# EAGLE design power-control (EAGLE 6.4)
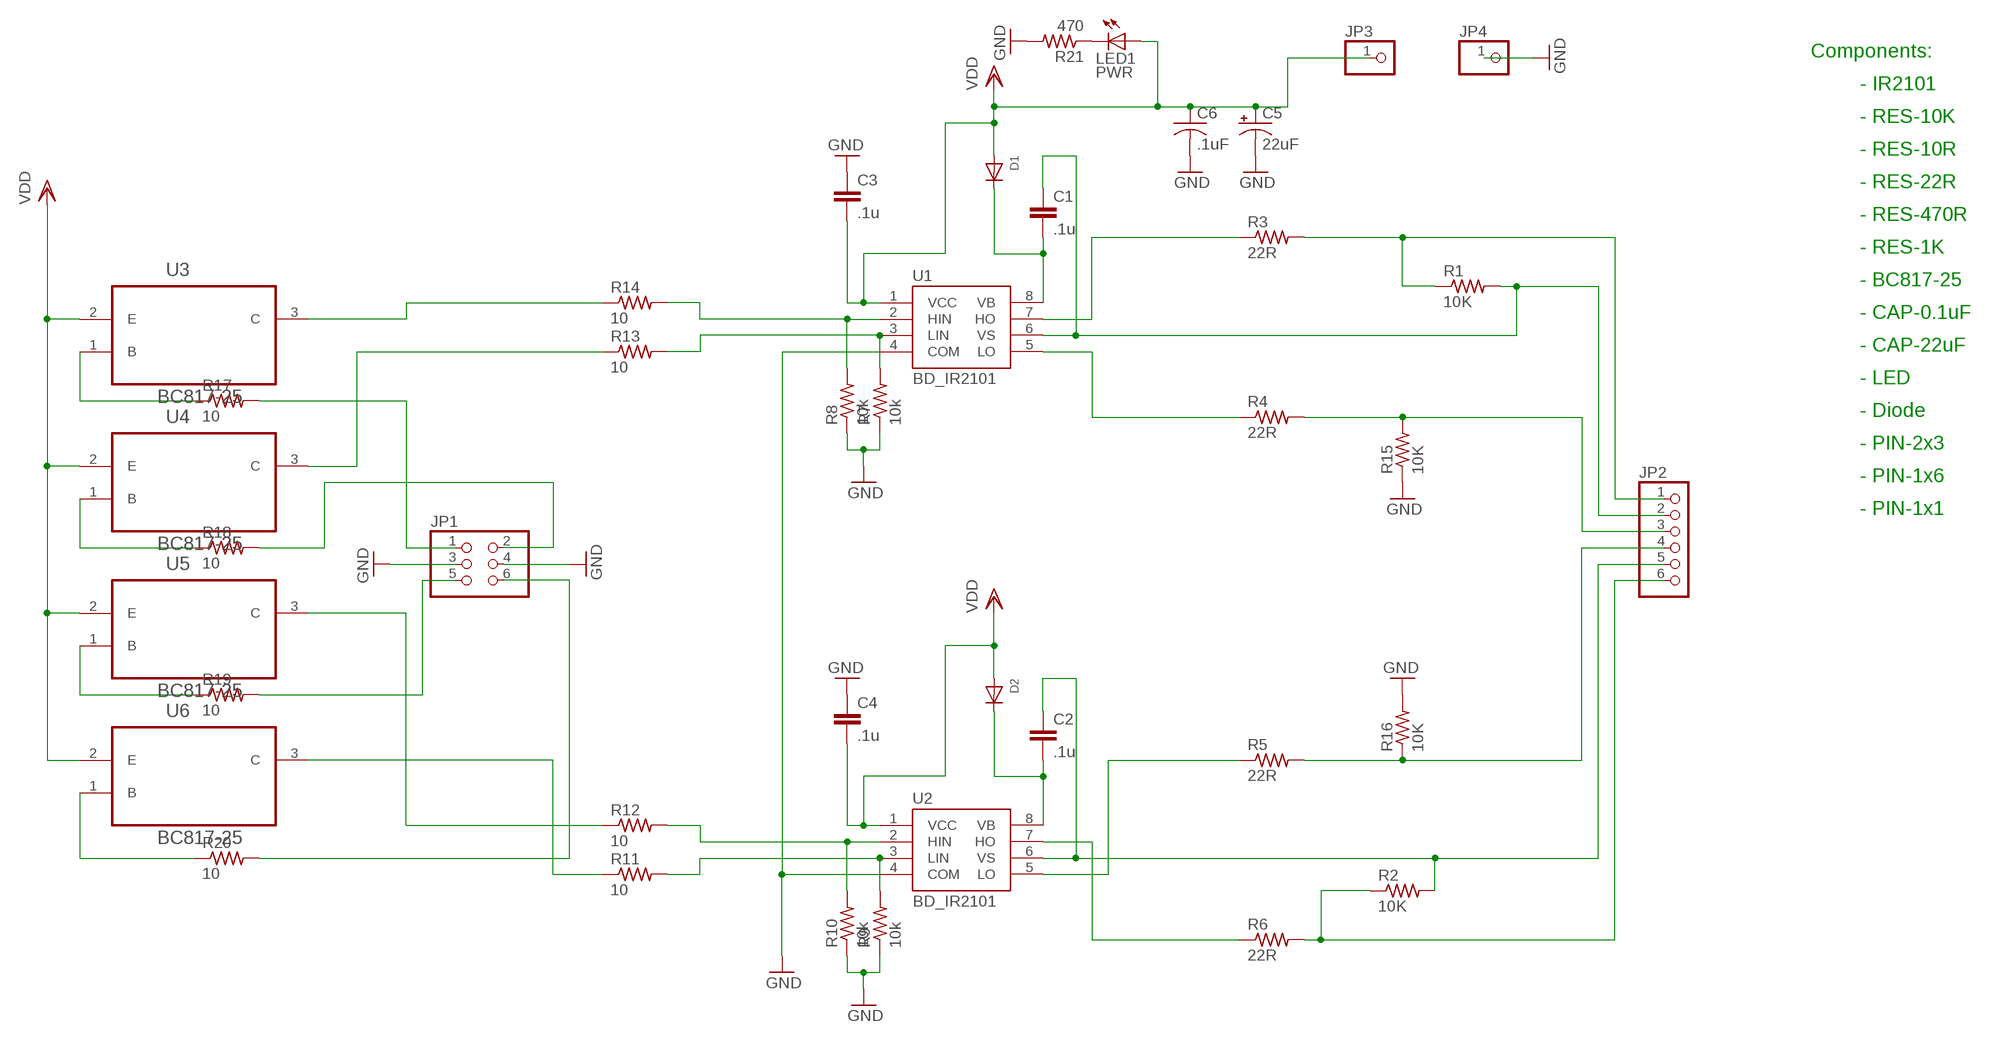
[diagram p0: schematic, sheet 1]

## Parts
C1  .1u  C-EUC0603  [C0603]
C2  .1u  C-EUC0603  [C0603]
C3  .1u  C-EUC0603  [C0603]
C4  .1u  C-EUC0603  [C0603]
C5  22uF  CPOL-USB/3528-21W  [B/3528-21W]
C6  .1uF  C-USC0805  [C0805]
D1  DIODESOD-523  [SOD-523]
D2  DIODESOD-523  [SOD-523]
JP1  PINHD-2X3  [2X03]
JP2  PINHD-1X6  [1X06]
JP3  PINHD-1X1  [1X01]
JP4  PINHD-1X1  [1X01]
LED1  PWR  LEDCHIP-LED0805  [CHIP-LED0805]
R1  10K  R-US_R0603  [R0603]
R2  10K  R-US_R0603  [R0603]
R3  22R  R-US_R0603  [R0603]
R4  22R  R-US_R0603  [R0603]
R5  22R  R-US_R0603  [R0603]
R6  22R  R-US_R0603  [R0603]
R7  10k  R-US_R0603  [R0603]
R8  10k  R-US_R0603  [R0603]
R9  10k  R-US_R0603  [R0603]
R10  10k  R-US_R0603  [R0603]
R11  10  R-US_R0603  [R0603]
R12  10  R-US_R0603  [R0603]
R13  10  R-US_R0603  [R0603]
R14  10  R-US_R0603  [R0603]
R15  10K  R-US_R0603  [R0603]
R16  10K  R-US_R0603  [R0603]
R17  10  R-US_R0603  [R0603]
R18  10  R-US_R0603  [R0603]
R19  10  R-US_R0603  [R0603]
R20  10  R-US_R0603  [R0603]
R21  470  R-US_R0603  [R0603]
U1  BD_IR2101  [SO8]
U2  BD_IR2101  [SO8]
U3  BC817-25  [SOT95P240X97-3N]
U4  BC817-25  [SOT95P240X97-3N]
U5  BC817-25  [SOT95P240X97-3N]
U6  BC817-25  [SOT95P240X97-3N]

## Nets
GND: C3.1 C4.1 C5.- C6.2 JP1.3 JP1.4 JP4.1 R7.1 R8.1 R9.1 R10.1 R15.1 R16.2 R21.2 U1.4(COM) U2.4(COM)
HO_1: R3.1 U1.7(HO)
HO_2: R6.1 U2.7(HO)
LO_1: R4.1 U1.5(LO)
LO_2: R5.1 U2.5(LO)
MOTOR_OUT_1: C1.1 JP2.2 R1.2 U1.6(VS)
MOTOR_OUT_2: C2.1 JP2.5 R2.2 U2.6(VS)
N$1: R13.1 U4.3(C)
N$2: R11.1 U6.3(C)
N$3: R8.2 R14.2 U1.2(HIN)
N$4: R7.2 R13.2 U1.3(LIN)
N$5: R10.2 R12.2 U2.2(HIN)
N$6: R9.2 R11.2 U2.3(LIN)
N$7: C1.2 D1.K(C) U1.8(VB)
N$8: C2.2 D2.K(C) U2.8(VB)
N$9: R12.1 U5.3(C)
N$10: JP2.4 R5.2 R16.1
N$11: R14.1 U3.3(C)
N$12: JP1.1 R17.2
N$13: JP1.5 R19.2
N$14: JP1.2 R18.2
N$15: JP2.1 R1.1 R3.2
N$16: JP1.6 R20.2
N$17: R17.1 U3.1(B)
N$18: R18.1 U4.1(B)
N$19: R19.1 U5.1(B)
N$20: JP2.3 R4.2 R15.2
N$21: R20.1 U6.1(B)
N$22: LED1.C R21.1
N$25: JP2.6 R2.1 R6.2
VDD: C3.2 C4.2 C5.+ C6.1 D1.A D2.A JP3.1 LED1.A U1.1(VCC) U2.1(VCC) U3.2(E) U4.2(E) U5.2(E) U6.2(E)

## Notes on the sheet
- Components:
- - IR2101
- - RES-10K
- - RES-10R
- - RES-22R
- - RES-470R
- - RES-1K
- - BC817-25
- - CAP-0.1uF
- - CAP-22uF
- - LED
- - Diode
- - PIN-2x3
- - PIN-1x6
- - PIN-1x1

## Library data of the parts
C1-C4 = rcl:C-EU: CAPACITOR, European symbol
C5 = rcl:CPOL-US: POLARIZED CAPACITOR, American symbol
C6 = rcl:C-US: CAPACITOR, American symbol
D1 D2 = adafruit:DIODE: Diode SMADIODE - SMA Surface Mount Package 20V 1A Schottky Diode Digikey: 641-1014-6-ND DO-1N4148 - Through Hole Small Current Diode SOD-123 20V 1 A (.5mV Vf) Schottky Diode - Digikey: MBRX120TPMSCT-ND SOD-323 10V 570mA (.38mV Vf, 3ns) Schottky Diode - Digikey: ZLLS410CT-ND SOD-523 30V 30mA Schottky Diode (RB751S-40TE61) - Digikey: RB751S-40TE61CT-ND SOT23-R/W - SOT23 Package (R = Solder Paste/Reflow Ovens, W = Hand-Soldering) BAT54Film 40V 300mA - Digikey: 497-7162-1-ND
JP1 = pinhead:PINHD-2X3: PIN HEADER
JP2 = pinhead:PINHD-1X6: PIN HEADER
JP3 JP4 = pinhead:PINHD-1X1: PIN HEADER
LED1 = adafruit:LED: LED OSRAM: - CHIPLED LG R971, LG N971, LY N971, LG Q971, LY Q971, LO R971, LY R971 LH N974, LH R974 LS Q976, LO Q976, LY Q976 LO Q996 - Hyper CHIPLED LW Q18S LB Q993, LB Q99A, LB R99A - SideLED LS A670, LO A670, LY A670, LG A670, LP A670 LB A673, LV A673, LT A673, LW A673 LH A674 LY A675 LS A676, LA A676, LO A676, LY A676, LW A676 LS A679, LY A679, LG A679 - Hyper Micro SIDELED® LS Y876, LA Y876, LO Y876, LY Y876 LT Y87S - SmartLED LW L88C, LW L88S LB L89C, LB L89S, LG L890 LS L89K, LO L89K, LY L89K LS L896, LA L896, LO L896, LY L896 - TOPLED LS T670, LO T670, LY T670, LG T670, LP T670 LSG T670, LSP T670, LSY T670, LOP T670, LYG T670 LG T671, LOG T671, LSG T671 LB T673, LV T673, LT T673, LW T673 LH T674 LS T676, LA T676, LO T676, LY T676, LB T676, LH T676, LSB T676, LW T676 LB T67C, LV T67C, LT T67C, LS T67K, LO T67K, LY T67K, LW E67C LS E67B, LA E67B, LO E67B, LY E67B, LB E67C, LV E67C, LT E67C LW T67C LS T679, LY T679, LG T679 LS T770, LO T770, LY T770, LG T770, LP T770 LB T773, LV T773, LT T773, LW T773 LH T774 LS E675, LA E675, LY E675, LS T675 LS T776, LA T776, LO T776, LY T776, LB T776 LHGB T686 LT T68C, LB T68C - Hyper Mini TOPLED® LB M676 - Mini TOPLED Santana® LG M470 LS M47K, LO M47K, LY M47K Source: http://www.osram.convergy.de/
R1-R21 = rcl:R-US_: RESISTOR, American symbol
U1 U2 = open-bldc:BD
U3-U6 = Fairchild_By_element14_Batch_1:BC817-25: NPN Epitaxial Silicon Transistor; MPN: BC817-25; OC_FARNELL: 1228216; OC_NEWARK: -; PACKAGE: SOT-3; SUPPLIER: Fairchild

## Board
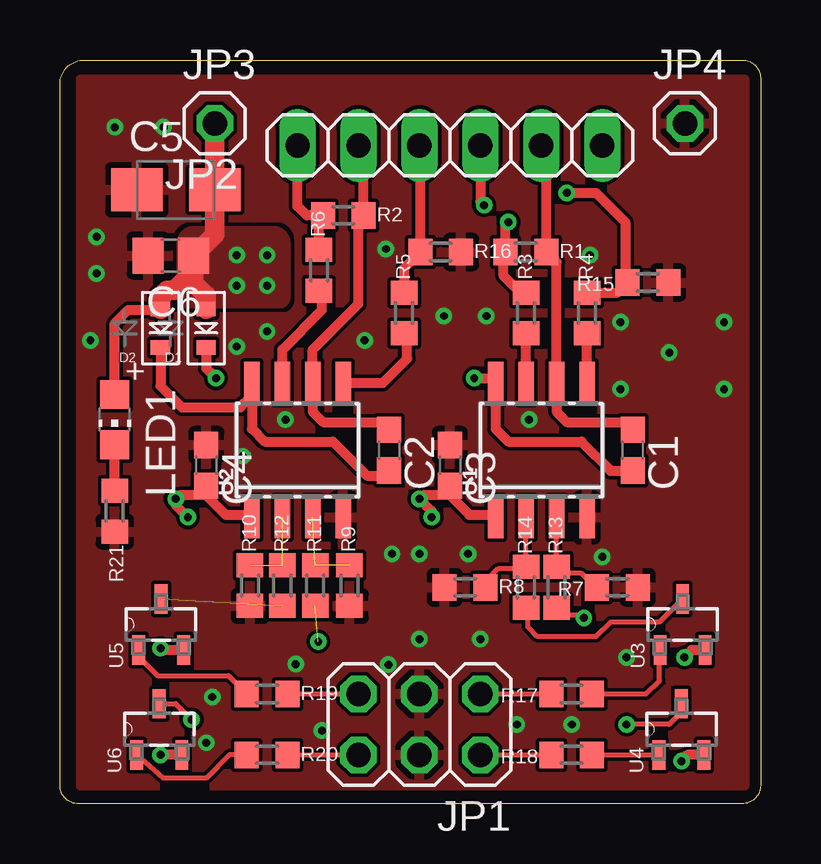
[diagram p1: board, top side]
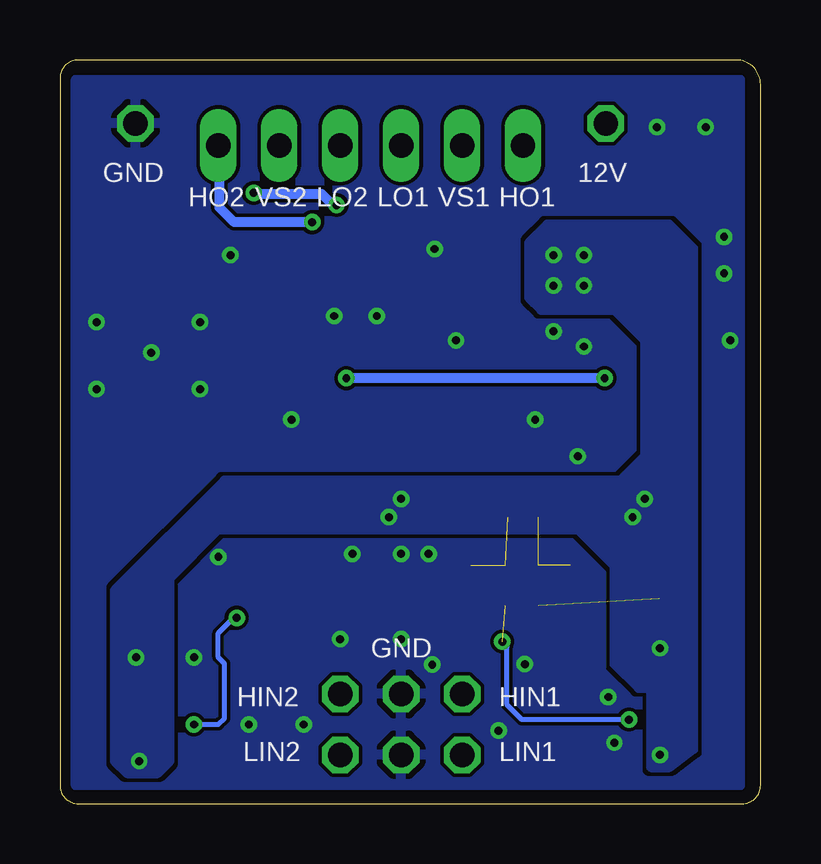
[diagram p2: board, bottom side, seen from below]

Size 29.21 x 30.99 mm. Coordinates in mm from the lower left corner, seen from the top.
Outline: 1.02,30.99 28.45,30.99 arc-90 29.21,30.23 29.21,0.76 arc-90 28.45,0 0.76,0 arc-90 0,0.76 0,29.97 arc-90 1.02,30.99
Copper layers (1*16): Top 0.0356mm / dielectric 1.5011mm / Bottom 0.0356mm
Design rules "LaenPCBOrder *": minimum track width 6mil, minimum drill 13mil, track to track 6mil, track to pad 6mil, pad to pad 6mil, via to via 6mil, smd to smd 6mil, copper to edge 15mil, drill to drill 6mil, minimum pad ring 7mil, minimum via ring 7mil, stop-mask expansion 4mil, vias tented up to drill 14mil, thermal gap 10mil

### Footprints (pad centres in the part's own frame; a part is rotated, then mirrored left to right if it is on the bottom)
C0603 = smd 1.1 x 1: 1 -0.85,0; 2 0.85,0
B/3528-21W = smd 2.15 x 1.8: + 1.625,0; - -1.625,0
C0805 = smd 1.3 x 1.5: 1 -0.95,0; 2 0.95,0
SOD-523 = smd 0.8 x 0.6: A 0,-0.8; K 0,0.8
2X03 = drill 1.016 octagon: 1 -2.54,-1.27; 2 -2.54,1.27; 3 0,-1.27; 4 0,1.27; 5 2.54,-1.27; 6 2.54,1.27
1X06 = drill 1.016 long: 1 -6.35,0; 2 -3.81,0; 3 -1.27,0; 4 1.27,0; 5 3.81,0; 6 6.35,0
1X01 = drill 1.016 octagon: 1 0,0
CHIP-LED0805 = smd 1.2 x 1.2: A 0,-1.05; C 0,1.05
R0603 = smd 1 x 1.1: 1 -0.85,0; 2 0.85,0
SO8 = smd 0.65 x 1.75: 1 -1.905,-2.8; 2 -0.635,-2.8; 3 0.635,-2.8; 4 1.905,-2.8; 5 1.905,2.8; 6 0.635,2.8; 7 -0.635,2.8; 8 -1.905,2.8
SOT95P240X97-3N = smd 1.219 x 0.533: 1 -1.067,0.94; 2 -1.067,-0.94; 3 1.067,0

### Placement (x,y rotation side)
C1  23.88,14.73 270 top
C2  13.72,14.73 270 top
C3  16.26,14.1 270 top
C4  6.1,14.1 270 top
C5  4.83,25.58 0 top
C6  4.62,22.83 180 top
D1  6.1,19.81 180 top
D2  4.19,19.81 180 top
JP1  14.99,3.3 180 top
JP2  16.26,27.43 180 top
JP3  6.45,28.35 0 top
JP4  26.06,28.35 0 top
LED1  2.29,16 180 top
R1  19.43,22.99 0 top
R2  11.81,24.51 0 top
R3  19.43,20.45 90 top
R4  21.97,20.45 90 top
R5  14.35,20.45 90 top
R6  10.8,22.23 90 top
R7  23.24,9.02 180 top
R8  16.89,9.02 0 top
R9  12.06,9.09 90 top
R10  7.92,9.09 90 top
R11  10.64,9.09 90 top
R12  9.27,9.09 90 top
R13  20.7,9.02 90 top
R14  19.43,9.02 90 top
R15  24.51,21.72 180 top
R16  15.88,22.99 0 top
R17  21.34,4.57 180 top
R18  21.34,2.03 180 top
R19  8.64,4.57 0 top
R20  8.64,2.03 0 top
R21  2.29,12.19 270 top
U1  20.07,14.73 0 top
U2  9.91,14.73 0 top
U3  25.96,7.47 90 top
U4  25.91,3.1 90 top
U5  4.22,7.47 90 top
U6  4.14,3.1 90 top

### Tracks (layer width: path | path; a pad name or v marks a point on that pad's centre or on a via)
GND  (via drill 0.33)
  other vias: 13.69,5.79 14.99,6.86 17.53,6.86 2.29,28.19 4.32,28.19 23.37,20.07 25.4,18.8 27.69,17.27 23.37,17.27 27.69,20.07 9.4,16 19.56,16 22.1,22.86 9.83,5.82 13.84,10.41 14.99,10.41 17.02,10.41 22.61,10.29 23.62,6.1 7.62,14.48 17.78,20.32 16,20.32 8.64,19.69 7.37,19.05 1.52,23.62 1.52,22.1 1.27,19.3 6.35,4.45 6.1,2.54 10.92,3.05 19.05,3.3 21.34,3.3 12.7,19.3 13.59,23.11
  pour Bottom (rank 6): 0.86,30.18 0.86,0.76 28.55,0.76 28.55,30.18
  pour Top (rank 6): 0.86,30.18 0.86,0.76 28.55,0.76 28.55,30.18
HO_1
  Top 0.406: U1.7 R3.1
HO_2
  Top 0.406: U2.7 9.27,18.92 10.92,20.57 10.92,21.25 R6.1
LO_1
  Top 0.406: U1.5 R4.1
LO_2
  Top 0.406: U2.5 13.47,17.53 14.48,18.54 14.48,19.47 R5.1
MOTOR_OUT_1
  Top 0.406: C1.1 23.56,15.9 21.13,15.9 20.7,16.33 U1.6 20.7,22.57 R1.2 20.28,27.22 JP2.2
MOTOR_OUT_2
  Top 0.406: C2.1 13.4,15.9 10.97,15.9 10.54,16.33 U2.6 10.54,18.92 12.45,20.83 12.45,24.3 R2.2 12.66,27.22 JP2.5
N$1  (via drill 0.33)
  Top 0.203: U4.3 25.91,3.81 25.4,3.3 v23.62,3.3 | R13.1 20.99,7.87 21.72,7.87 v21.84,7.75
  Bottom 0.203: v23.62,3.3 22.61,3.3 22.35,3.56 22.35,5.84 22.61,6.1 22.61,7.11 21.97,7.75 v21.84,7.75
N$2  (via drill 0.33)  (1 unrouted)
  Top 0.203: U6.3 4.83,4.17 v5.49,3.5
  Bottom 0.203: v5.49,3.5 9.96,3.5 10.57,4.11 10.57,6.55 v10.77,6.76
N$3
  Top 0.203: U1.2 R14.2 19.37,9.8 18.29,9.8 17.74,9.26 R8.2
N$4
  Top 0.203: U1.3 R13.2 20.97,9.6 21.74,9.6 22.33,9.02 R7.2
N$5  (2 unrouted)
N$6  (2 unrouted)
N$7  (via drill 0.33)
  Top 0.406: C1.2 23.86,13.87 22.96,13.87 21.74,15.09 18.69,15.09 18.16,15.62 U1.8 17.96,17.73 v17.27,17.73 | D1.K 6.1,18.14 v6.5,17.73
  Bottom 0.406: v6.5,17.73 v17.27,17.73
N$8
  Top 0.406: D2.K 4.19,17.4 5.08,16.51 7.52,16.51 7.92,16.92 7.92,17.46 U2.8 8,15.62 8.53,15.09 11.38,15.09 12.8,13.66 13.5,13.66 C2.2
N$9  (1 unrouted)
N$10
  Top 0.406: JP2.4 15.02,27.39 R16.1 14.35,22.31 R5.2
N$11
  Top 0.203: U3.3 24.99,7.57 22.96,7.57 22.35,6.96 19.91,6.96 19.51,7.37 19.51,8.09 R14.1
N$12
  Top 0.203: JP1.1 R17.2
N$13
  Top 0.203: R19.2 JP1.5
N$14
  Top 0.203: JP1.2 R18.2
N$15  (via drill 0.33)
  Top 0.406: R3.2 19.19,21.3 18.49,22 18.49,22.9 R1.1 18.58,24.12 v18.69,24.23
  Bottom 0.406: v18.69,24.23 21.95,24.23 22.55,24.84 22.55,27.38 JP2.1
N$16
  Top 0.203: R20.2 JP1.6
N$17
  Top 0.203: R17.1 24.43,4.57 24.99,5.13 24.99,6.38 U3.1
N$18
  Top 0.203: R18.1 U4.1
N$19
  Top 0.203: U5.1 3.28,6.12 4.06,5.33 7.02,5.33 R19.1
N$20  (via drill 0.33)
  Top 0.406: v21.13,25.45 22.35,25.45 23.57,24.23 23.57,21.81 R15.2 23.24,21.3 R4.2 | JP2.3 17.53,25.09 v17.68,24.94
  Bottom 0.406: v17.68,24.94 17.83,24.94 18.29,25.4 21.08,25.4 v21.13,25.45
N$21
  Top 0.203: R20.1 7.06,2.03 6.1,1.07 4.29,1.07 U6.1
N$22
  Top 0.406: R21.1 LED1.C
N$25
  Top 0.406: JP2.6 9.91,24.89 10.29,24.51 R2.1 10.8,24.34 R6.2
VDD  (via drill 0.33)
  Top 0.406: C4.2 6.1,12.85 | 6.1,12.85 6.91,12.04 7.89,12.04 U2.1 | C3.2 16.26,12.85 | 16.26,12.85 17.07,12.04 18.05,12.04 U1.1 | LED1.A 2.29,20.02 2.84,20.57 4.15,20.57 D2.A | U5.2 4.27,6.4 v4.19,6.48 | U6.2 v4.19,2.03 | U3.2 26.34,6.4 v26.04,6.1 | U4.2 26.16,2.03 v25.91,1.78 | 16.26,12.85 15.14,12.85 v14.99,12.7 15.49,12.19 v15.49,11.94 | 6.1,12.85 4.98,12.85 v4.83,12.7 4.83,12.45 v5.33,11.94
  Top 0.813: JP3.1 C5.+ 6.45,23.71 C6.1 5.57,22.2 | 5.57,22.2 5.57,21.71 6.1,21.18 D1.A | D2.A 4.19,21.11 4.47,21.39 4.76,21.39 5.57,22.2
  other vias: 7.37,22.86 8.64,22.86 7.37,21.59 8.64,21.59
  pour Top (rank 5, no thermals): 7.11,23.88 8.89,23.88 arc-90 9.4,23.37 9.4,21.08 arc-90 9.14,20.83 5.33,20.83 arc-90 5.08,21.08 5.08,23.37 arc-90 5.59,23.88
  pour Bottom: 3.81,24.13 8.89,24.13 9.65,23.37 9.65,21.08 9.14,20.57 6.1,20.57 4.83,19.3 4.83,14.48 5.84,13.46 22.35,13.46 26.92,8.89 26.92,1.78 26.42,1.27 25.15,1.27 24.64,1.78 24.64,9.4 22.61,11.43 7.62,11.43 6.1,9.91 6.1,5.84 5.08,4.83 4.57,4.83 4.57,1.52 3.81,1.52 2.79,2.29 2.79,23.11

### Text on the board
bPlace: 12V | GND | HO1 | VS1 | LO1 | LO2 | VS2 | HO2 | GND | HIN1 | HIN2 | LIN1 | LIN2
tDocu: Components: | - IR2101 | 2 | - RES 1k 0603 | 4 | - RES 10k 0603 | 4 | - RES 10k 0603 | 2 | - RES 22 0603 | 4 | - CAP 100nF 0603 | 2 | - CAP 10uF 0603 | 2 | - PINHEAD 1X6 | 1 | - PINHEAD 2X3 | 1 | - PINHEAD 1X1 | 2 | - DIODE SOT23 | 2